# Altium project Controller.PrjPcb (part 2 of 2)

## Sheet 08_User_IO.SchDoc: User IO
size A; Revision: A; SheetNumber: 8; SheetTotal: 8; ECE315_Project_Name: ECE453 MCU Base Project
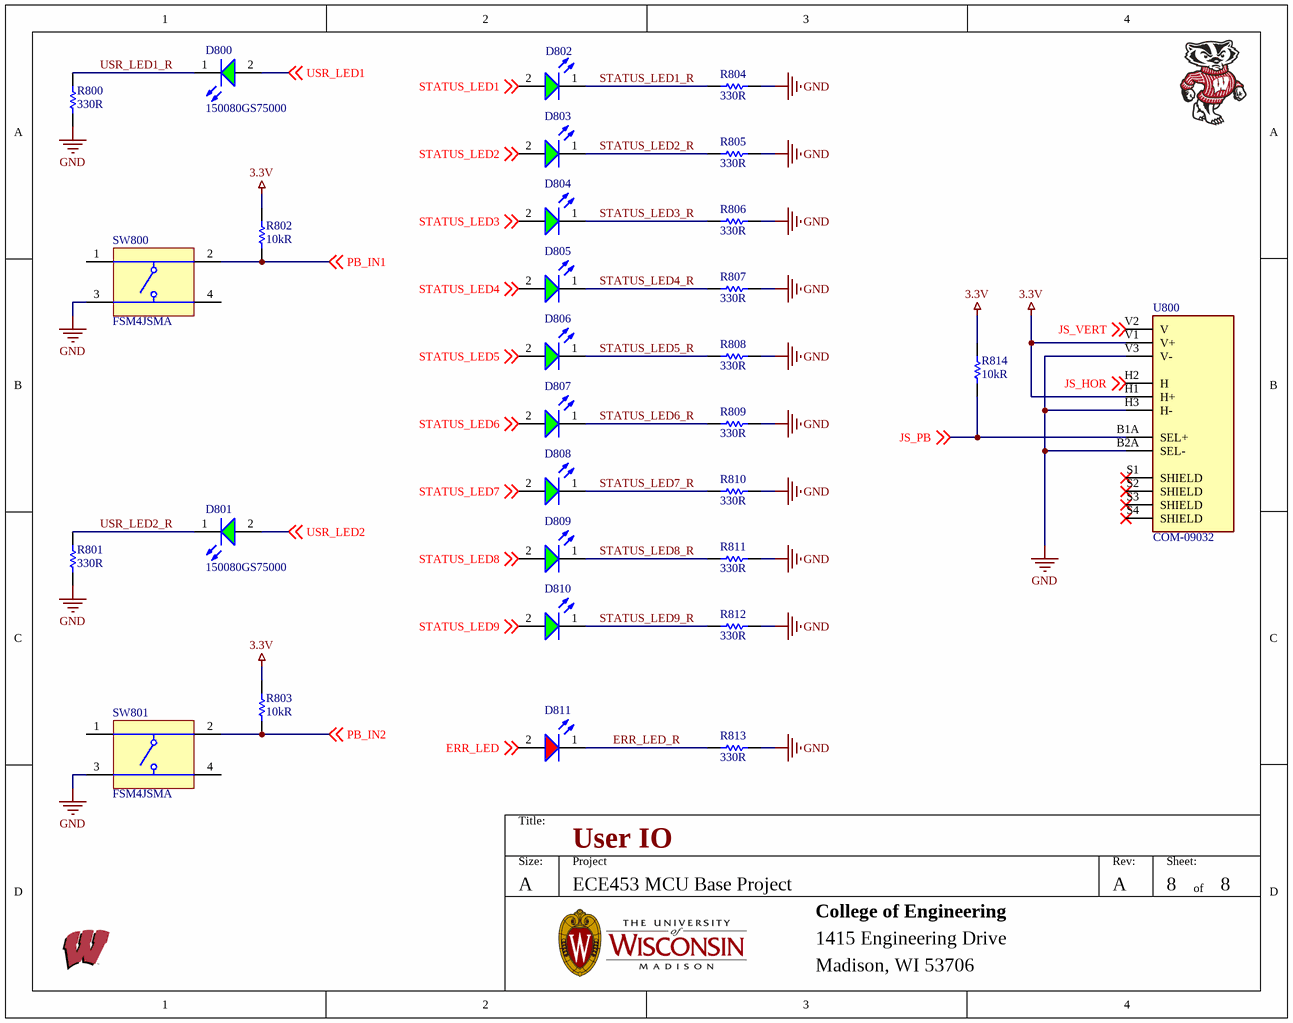
[diagram p7: 08_User_IO.SchDoc]

### Parts
D800  150080GS75000  [WL-SMCW_0805_150080xx75000]
D801  150080GS75000  [WL-SMCW_0805_150080xx75000]
D802  (no value)  [WL-SMCW_0805_150080xx75000]
D803  (no value)  [WL-SMCW_0805_150080xx75000]
D804  (no value)  [WL-SMCW_0805_150080xx75000]
D805  (no value)  [WL-SMCW_0805_150080xx75000]
D806  (no value)  [WL-SMCW_0805_150080xx75000]
D807  (no value)  [WL-SMCW_0805_150080xx75000]
D808  (no value)  [WL-SMCW_0805_150080xx75000]
D809  (no value)  [WL-SMCW_0805_150080xx75000]
D810  (no value)  [WL-SMCW_0805_150080xx75000]
D811  (no value)  [WL-SMCW_0805_150080xx75000]
R800  330R  [RESC2013X60X40LL20T25]
R801  330R  [RESC2013X60X40LL20T25]
R802  10kR  [RESC2013X70X40ML20T20]
R803  10kR  [RESC2013X70X40ML20T20]
R804  330R  [RESC2013X60X40LL20T25]
R805  330R  [RESC2013X60X40LL20T25]
R806  330R  [RESC2013X60X40LL20T25]
R807  330R  [RESC2013X60X40LL20T25]
R808  330R  [RESC2013X60X40LL20T25]
R809  330R  [RESC2013X60X40LL20T25]
R810  330R  [RESC2013X60X40LL20T25]
R811  330R  [RESC2013X60X40LL20T25]
R812  330R  [RESC2013X60X40LL20T25]
R813  330R  [RESC2013X60X40LL20T25]
R814  10kR  [RESC2013X70X40ML20T20]
SW800  FSM4JSMA  [TECO-FSM4JSMA_V]
SW801  FSM4JSMA  [TECO-FSM4JSMA_V]
U800  COM-09032  [XDCR_COM-09032]

### Nets
3.3V: R802.2 R803.2 R814.2 U800.H1(H+) U800.V1(V+)
GND: R800.2 R801.2 R804.2 R805.2 R806.2 R807.2 R808.2 R809.2 R810.2 R811.2 R812.2 R813.2 SW800.3 SW801.3 U800.B2A(SEL-) U800.H3(H-) U800.V3(V-)
ERR_LED: D811.2(A) ; off-sheet ERR_LED
ERR_LED_R: D811.1(K) R813.1
JS_HOR: U800.H2(H) ; off-sheet JS_HOR
JS_PB: R814.1 U800.B1A(SEL+) ; off-sheet JS_PB
JS_VERT: U800.V2(V) ; off-sheet JS_VERT
PB_IN1: R802.1 SW800.2 ; off-sheet PB_IN1
PB_IN2: R803.1 SW801.2 ; off-sheet PB_IN2
STATUS_LED1: D802.2(A) ; off-sheet STATUS_LED1
STATUS_LED1_R: D802.1(K) R804.1
STATUS_LED2: D803.2(A) ; off-sheet STATUS_LED2
STATUS_LED2_R: D803.1(K) R805.1
STATUS_LED3: D804.2(A) ; off-sheet STATUS_LED3
STATUS_LED3_R: D804.1(K) R806.1
STATUS_LED4: D805.2(A) ; off-sheet STATUS_LED4
STATUS_LED4_R: D805.1(K) R807.1
STATUS_LED5: D806.2(A) ; off-sheet STATUS_LED5
STATUS_LED5_R: D806.1(K) R808.1
STATUS_LED6: D807.2(A) ; off-sheet STATUS_LED6
STATUS_LED6_R: D807.1(K) R809.1
STATUS_LED7: D808.2(A) ; off-sheet STATUS_LED7
STATUS_LED7_R: D808.1(K) R810.1
STATUS_LED8: D809.2(A) ; off-sheet STATUS_LED8
STATUS_LED8_R: D809.1(K) R811.1
STATUS_LED9: D810.2(A) ; off-sheet STATUS_LED9
STATUS_LED9_R: D810.1(K) R812.1
USR_LED1: D800.2(A) ; off-sheet USR_LED1
USR_LED1_R: D800.1(K) R800.1
USR_LED2: D801.2(A) ; off-sheet USR_LED2
USR_LED2_R: D801.1(K) R801.1

Not connected (* = marked no-connect by the designer): SW800 1 4; SW801 1 4; U800 S1(SHIELD)* S2(SHIELD)* S3(SHIELD)* S4(SHIELD)*

### Notes on the sheet
- Title:
- Size:
- A
- Project
- Rev:
- Sheet:
- of
- College of Engineering
- 1415 Engineering Drive
- Madison, WI 53706

### Library data of the parts
D800-D810 = CMP-1426-00007-2: NexarPartId: 29717780; Wavelength: 520nm; Forward Current: 100mA; Lens Style: Clear, Rectangular; Dominant Wavelength: 525nm; Max Junction Temperature (Tj): 95°C; Power Dissipation: 105mW; Luminous Intensity: 450mcd; Peak Wavelength: 515nm; Color: Green; Viewing Angle: 140°; Test Current: 20mA; Reverse Voltage: 5V; Forward Voltage: 3.2V; Mount: Surface Mount; REACH SVHC: Unknown; Min Operating Temperature: -40°C; Case Code (Imperial): 0805; Case/Package: 0805; Max Operating Temperature: 85°C; RoHS: Compliant; Length: 2mm; Height: 700µm; Width: 1.25mm; Case Code (Metric): 2012; Packaging: Tape and Reel; Max Reverse Voltage (DC): 5V
D811 = CMP-1426-00011-2: NexarPartId: 29717781; Peak Wavelength: 630nm; Wavelength: 625nm; Viewing Angle: 140°; Test Current: 20mA; Forward Voltage: 2V; Forward Current: 100mA; Lens Style: Clear, Rectangular; Color: Red; Luminous Intensity: 150mcd; Max Reverse Voltage (DC): 5V; Length: 2mm; Case Code (Imperial): 0805; RoHS: Compliant; Max Operating Temperature: 85°C; Height: 700µm; Packaging: Tape and Reel; Case/Package: 0805; REACH SVHC: Unknown; Dominant Wavelength: 625nm; Min Operating Temperature: -40°C; Case Code (Metric): 2012; Mount: Surface Mount; Width: 1.25mm
R800 R801 R804-R813 = CMP-2001-00628-1: Manufacturer: Panasonic; Part Number: ERA6AEB331V
R802 R803 R814 = CMP-2001-04376-1: Manufacturer: Panasonic; Part Number: ERJ-6ENF1002V
SW800 SW801 = CMP-2000-05602-2: Swicth, SPST, 24 V, -35 to 85 degC, 4-Pin SMD, RoHS, Tape and Reel; Manufacturer: TE Connectivity; Switch Travel: 0.25mm; Mechanical Life: 100000Cycles; Contact Current Rating: 50mA; Operating Force: 1.57N; Actuator Material: Polyamide; Contact Resistance: 100mOhm; Voltage Rating: 24V; Illumination Type: Illuminated; Actuator Length: 0.055inch; Max Voltage Rating (DC): 12V; Case\/Package: SMD/SMT; Orientation: Straight; Datasheet URL: http://www.te.com/commerce/DocumentDelivery/DDEController?Action=showdoc&DocId=Customer+Drawing%7F2-1437565-7%7FV%7Fpdf%7FEnglish%7FENG_CD_2-1437565-7_V.pdf%7F4-1437565-2; Min Operating Temperature: -35degC; Packaging: LoosePiece; Termination: GullWing; Throw Configuration: SPST; Package Description: 4-Pin Surface Mount Device, Body 6 x 6 mm, Pitch 4.5 mm; Mounting Technology: SurfaceMount; Contact Plating: Silver; Datasheet Version: Rev. V, 02/2015; RoHSCompliant: true; Max Operating Temperature: 85degC; Length: 6mm; Voltage Rating (DC): 24V; Electrical Life: 100000Cycles; Current Rating: 50mA; Package Quantity: 750; Mount: SurfaceMount; Package Reference: FSM4JSMA; Manufacturer URL: http://www.te.com/; Width: 6mm; REACH SVHC: Unknown; Contact Material: CopperAlloy
U800 = COM-09032: Thumb Joystick; Price: None; Availability: Unavailable; MP: COM-09032; Value: *; Package: None

## Nets that join several sheets
3.3V: 02_USB_Bridge (5 pins), 03_Connectors (J301.1), 04_PSoC6 (C402.1 C403.1 MD400.4), 05_Mechanical (J501.4), 06_Power (C600.2 C602.1 U600.2 U600.4), 07_Programming_Reset (7 pins), 08_User_IO (5 pins)
5.0V_USB: 02_USB_Bridge (L200.2), 06_Power (C607.1 D601.2 U602.4)
GND: 02_USB_Bridge (11 pins), 03_Connectors (J301.4 J301.5), 04_PSoC6 (7 pins), 05_Mechanical (J500.1 J501.1 J502.15), 06_Power (17 pins), 07_Programming_Reset (6 pins), 08_User_IO (17 pins)
ERR_LED: 05_Mechanical (R529.2), 08_User_IO (D811.2)
J5.0: 03_Connectors (J302.2), 05_Mechanical (R501.2)
J5.1: 03_Connectors (J302.3), 05_Mechanical (R500.2)
J5.2: 03_Connectors (J302.6), 05_Mechanical (R502.2)
J5.3: 03_Connectors (J302.7), 05_Mechanical (R504.2)
J9.0: 03_Connectors (J302.1), 05_Mechanical (R522.2)
J9.1: 03_Connectors (J302.4), 05_Mechanical (R521.2)
J9.2: 03_Connectors (J302.5), 05_Mechanical (R520.2)
J9.3: 03_Connectors (J302.8), 05_Mechanical (R507.2)
J10.0: 03_Connectors (J301.2), 05_Mechanical (R513.2)
J10.1: 03_Connectors (J301.3), 05_Mechanical (R511.2)
J10.2: 03_Connectors (J301.6), 05_Mechanical (R510.2)
J10.3: 03_Connectors (J301.7), 05_Mechanical (R503.2)
J10.4: 03_Connectors (J301.8), 05_Mechanical (R505.2)
JS_HOR: 05_Mechanical (R508.2), 08_User_IO (U800.H2)
JS_PB: 05_Mechanical (R523.2), 08_User_IO (R814.1 U800.B1A)
JS_VERT: 05_Mechanical (R509.2), 08_User_IO (U800.V2)
MCP_URX: 02_USB_Bridge (U200.5), 05_Mechanical (R514.2)
MCP_UTX: 02_USB_Bridge (U200.6), 05_Mechanical (R517.2)
P0.4: 04_PSoC6 (R408.1), 05_Mechanical (J500.3 R523.1)
P0.5: 04_PSoC6 (R410.1), 05_Mechanical (J501.2 R524.1)
P5.0: 04_PSoC6 (R412.1), 05_Mechanical (J500.5 R501.1)
P5.1: 04_PSoC6 (R414.1), 05_Mechanical (J500.4 R500.1)
P5.2: 04_PSoC6 (R416.1), 05_Mechanical (J500.6 R502.1)
P5.3: 04_PSoC6 (R418.1), 05_Mechanical (J500.7 R504.1)
P5.4: 04_PSoC6 (R420.1), 05_Mechanical (J502.5 R531.1)
P5.5: 04_PSoC6 (R422.1), 05_Mechanical (J500.8 R506.1)
P5.6: 04_PSoC6 (R424.1), 05_Mechanical (J500.12 R512.1)
P6.2: 04_PSoC6 (R427.1), 05_Mechanical (J502.2 R530.1)
P6.3: 04_PSoC6 (R429.1), 05_Mechanical (J500.14 R528.1)
P6.4: 04_PSoC6 (R430.1), 05_Mechanical (J502.6 R517.1)
P6.5: 04_PSoC6 (R431.1), 05_Mechanical (J502.1 R514.1)
P6.6: 04_PSoC6 (R432.1), 05_Mechanical (J502.3 R515.1)
P6.7: 04_PSoC6 (R433.1), 05_Mechanical (J502.4 R516.1)
P7.1: 04_PSoC6 (R400.2), 05_Mechanical (J502.7 R518.1)
P7.2: 04_PSoC6 (R401.2), 05_Mechanical (J502.8 R519.1)
P7.7: 04_PSoC6 (R402.2), 05_Mechanical (J500.13 R527.1)
P9.0: 04_PSoC6 (R403.2), 05_Mechanical (J502.13 R522.1)
P9.1: 04_PSoC6 (R404.2), 05_Mechanical (J502.12 R521.1)
P9.2: 04_PSoC6 (R405.2), 05_Mechanical (J502.9 R520.1)
P9.3: 04_PSoC6 (R406.2), 05_Mechanical (J501.9 R507.1)
P9.4: 04_PSoC6 (R407.2), 05_Mechanical (J501.14 R529.1)
P9.5: 04_PSoC6 (R409.2), 05_Mechanical (J502.11 R533.1)
P9.6: 04_PSoC6 (R411.2), 05_Mechanical (J502.10 R532.1)
P10.0: 04_PSoC6 (R413.2), 05_Mechanical (J501.13 R513.1)
P10.1: 04_PSoC6 (R415.2), 05_Mechanical (J501.12 R511.1)
P10.2: 04_PSoC6 (R417.2), 05_Mechanical (J500.11 R510.1)
P10.3: 04_PSoC6 (R419.2), 05_Mechanical (J501.7 R503.1)
P10.4: 04_PSoC6 (R421.2), 05_Mechanical (J501.8 R505.1)
P10.5: 04_PSoC6 (R423.2), 05_Mechanical (J501.11 R509.1)
P10.6: 04_PSoC6 (R425.2), 05_Mechanical (J501.10 R508.1)
P12.6: 04_PSoC6 (R426.2), 05_Mechanical (J500.10 R526.1)
P12.7: 04_PSoC6 (R428.2), 05_Mechanical (J500.9 R525.1)
PB_IN1: 05_Mechanical (R512.2), 08_User_IO (R802.1 SW800.2)
PB_IN2: 05_Mechanical (R518.2), 08_User_IO (R803.1 SW801.2)
STATUS_LED1: 05_Mechanical (R525.2), 08_User_IO (D802.2)
STATUS_LED2: 05_Mechanical (R526.2), 08_User_IO (D803.2)
STATUS_LED3: 05_Mechanical (R527.2), 08_User_IO (D804.2)
STATUS_LED4: 05_Mechanical (R528.2), 08_User_IO (D805.2)
STATUS_LED5: 05_Mechanical (R530.2), 08_User_IO (D806.2)
STATUS_LED6: 05_Mechanical (R531.2), 08_User_IO (D807.2)
STATUS_LED7: 05_Mechanical (R532.2), 08_User_IO (D808.2)
STATUS_LED8: 05_Mechanical (R533.2), 08_User_IO (D809.2)
STATUS_LED9: 05_Mechanical (R524.2), 08_User_IO (D810.2)
SWDCLK: 05_Mechanical (R516.2), 07_Programming_Reset (P700.4)
SWDIO: 05_Mechanical (R515.2), 07_Programming_Reset (P700.5)
USR_LED1: 05_Mechanical (R506.2), 08_User_IO (D800.2)
USR_LED2: 05_Mechanical (R519.2), 08_User_IO (D801.2)
XRES_N: 04_PSoC6 (MD400.42 TP400.1), 05_Mechanical (J500.2), 07_Programming_Reset (D701.2 U701.4)